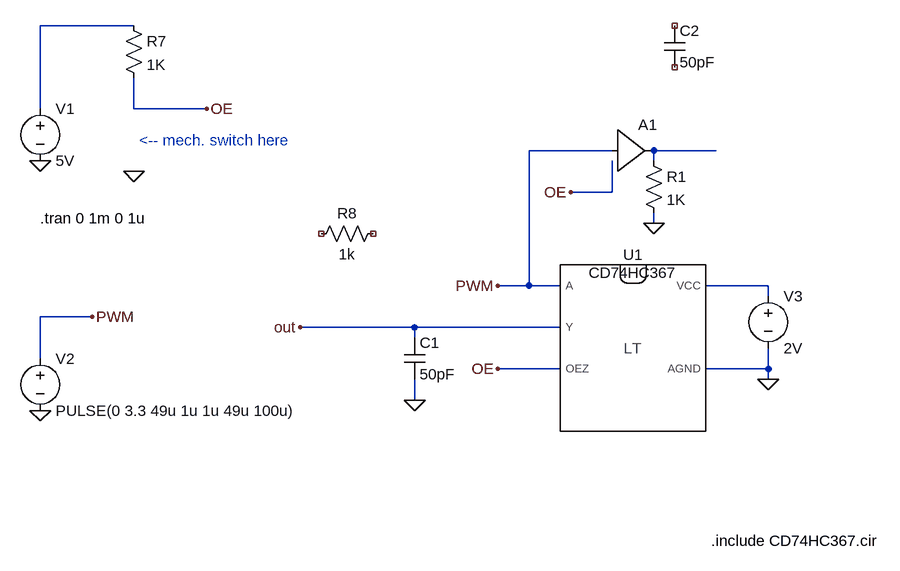
[diagram p0: schematic buffer.asc]
buffer.asc, the LTspice schematic file:
Version 4
SHEET 1 2104 6172
WIRE -416 -208 -560 -208
WIRE -560 -80 -560 -208
WIRE -416 -80 -416 -128
WIRE -304 -80 -416 -80
WIRE 320 -16 192 -16
WIRE 480 -16 384 -16
WIRE 384 0 384 -16
WIRE 320 48 320 0
WIRE 320 48 256 48
WIRE 384 96 384 80
WIRE 192 192 192 -16
WIRE 192 192 144 192
WIRE 240 192 192 192
WIRE 560 192 464 192
WIRE 560 208 560 192
WIRE -480 240 -560 240
WIRE 16 256 -160 256
WIRE 240 256 16 256
WIRE 16 272 16 256
WIRE -560 304 -560 240
WIRE 240 320 144 320
WIRE 560 320 560 288
WIRE 560 320 464 320
WIRE 560 336 560 320
WIRE 16 368 16 336
FLAG -560 384 0
FLAG -560 0 0
FLAG -304 -80 OE
FLAG -480 240 PWM
FLAG -416 16 0
FLAG 560 336 0
FLAG 16 368 0
FLAG 144 192 PWM
FLAG 144 320 OE
FLAG -160 256 out
FLAG 256 48 OE
FLAG 384 96 0
SYMBOL voltage -560 -96 R0
WINDOW 123 0 0 Left 0
WINDOW 39 0 0 Left 0
SYMATTR InstName V1
SYMATTR Value 5V
SYMBOL voltage -560 288 R0
WINDOW 123 0 0 Left 0
WINDOW 39 0 0 Left 0
SYMATTR InstName V2
SYMATTR Value PULSE(0 3.3 49u 1u 1u 49u 100u)
SYMBOL res -432 -224 R0
SYMATTR InstName R7
SYMATTR Value 1K
SYMBOL DIP8_CD74HC367 352 288 R0
WINDOW 3 0 -116 Center 2
SYMATTR InstName U1
SYMATTR Value CD74HC367
SYMBOL voltage 560 192 R0
WINDOW 123 0 0 Left 0
WINDOW 39 0 0 Left 0
SYMATTR InstName V3
SYMATTR Value 2V
SYMBOL cap 0 272 R0
SYMATTR InstName C1
SYMATTR Value 50pF
SYMBOL res -32 96 R90
WINDOW 0 0 56 VBottom 2
WINDOW 3 32 56 VTop 2
SYMATTR InstName R8
SYMATTR Value 1k
SYMBOL res 368 -16 R0
SYMATTR InstName R1
SYMATTR Value 1K
SYMBOL Digital\\buf1 320 -80 R0
SYMATTR InstName A1
SYMBOL cap 400 -208 R0
SYMATTR InstName C2
SYMATTR Value 50pF
TEXT -560 88 Left 2 !.tran 0 1m 0 1u
TEXT -408 -32 Left 2 ;<-- mech. switch here
TEXT 472 584 Left 2 !.include CD74HC367.cir

The netlist it stands for:
* buffer.asc
V1 N001 0 5V
V2 PWM 0 PULSE(0 3.3 49u 1u 1u 49u 100u)
R7 N001 OE 1K
XU1 PWM out OE N003 0 CD74HC367  ; pins A Y OEZ VCC AGND
V3 N003 0 2V
C1 out 0 50pF
R8 NC_01 NC_02 1k
R1 N002 0 1K
A1 PWM OE OE OE OE OE N002 OE BUF
C2 NC_03 NC_04 50pF
.tran 0 1m 0 1u
* <-- mech. switch here
.include CD74HC367.cir
.backanno
.end